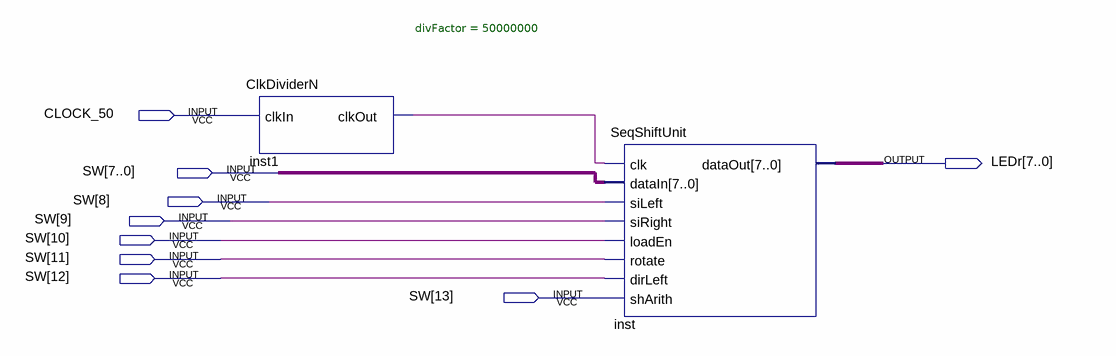
[diagram p0: schematic sheet]
// Quartus schematic SeqShiftUnit_Demo.bdf as structural Verilog: 2 symbols, 9 pins
module SeqShiftUnit_Demo (
  input  CLOCK_50,
  input  [13:0] SW,
  output [7:0] LEDr
);

  wire inst1_clkout;

  ClkDividerN #(.divFactor(50000000)) inst1 (.clkIn(CLOCK_50), .clkOut(inst1_clkout));
  SeqShiftUnit inst (
    .clk(inst1_clkout), .dataIn(SW[7:0]), .siLeft(SW[8]), .siRight(SW[9]), .loadEn(SW[10]), .rotate(SW[11]),
    .dirLeft(SW[12]), .shArith(SW[13]), .dataOut(LEDr));
endmodule
